# Altium schematic sheet xl4015.SchDoc
size A4
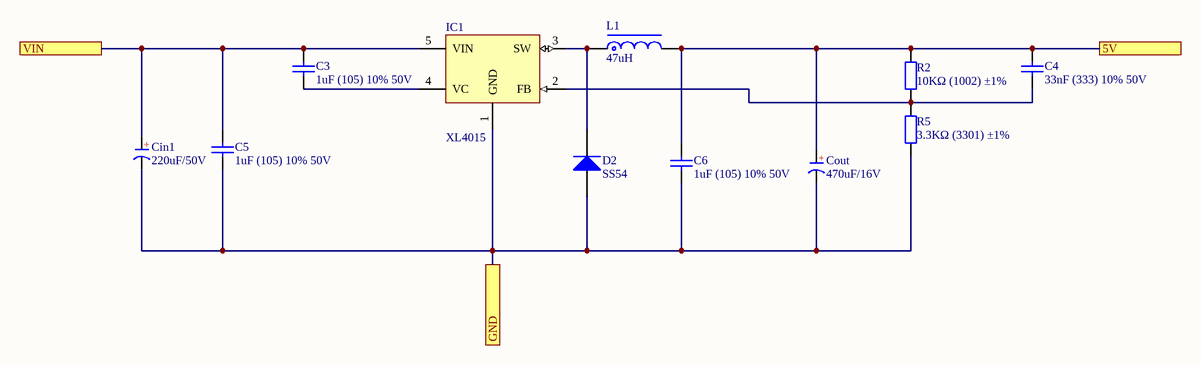
[diagram p0: xl4015.SchDoc]

## Parts
C3  1uF (105) 10% 50V  [0805_C]
C4  33nF (333) 10% 50V  [0805_C]
C5  1uF (105) 10% 50V  [0805_C]
C6  1uF (105) 10% 50V  [0805_C]
Cin1  220uF/50V  [CM F(10*10.2)]
Cout  470uF/16V  [CM E(8*10.2)]
D2  SS54  [SMA(DO-214AC)_S1]
IC1  XL4015  [TO263-5A]
L1  47uH  [CDRH127]
R2  10KΩ (1002) ±1%  [0805_R]
R5  3.3KΩ (3301) ±1%  [0805_R]

## Ports
5V, GND, VIN

## Nets
5V: C4.2 C6.2 Cout.1(A) L1.2 R2.2 ; port 5V
GND: C5.1 C6.1 Cin1.2(K) Cout.2(K) D2.1(A) IC1.1(GND) R5.1 ; port GND
VIN: C3.2 C5.2 Cin1.1(A) IC1.5(VIN) ; port VIN
NetC3_1: C3.1 IC1.4(VC)
NetC4_1: C4.1 IC1.2(FB) R2.1 R5.2
NetD2_2: D2.2(K) IC1.3(SW) L1.1

## Notes on the sheet
- (in symbol C-CM) +

## Library data of the parts
C3 C5 C6 = 0805 1uF (105) 10% 50V: 贴片电容; ComponentLink1Description: 供应商链接; ComponentLink1URL: http://www.szlcsc.com/product/details_29074.html; Package: 0805; Supplier: LC; SuppliersPartNumber: C28323
C4 = 0805 33nF (333) 10% 50V: 贴片电容; ComponentLink1Description: 供应商链接; ComponentLink1URL: http://www.szlcsc.com/product/details_2091.html; Package: 0805; Supplier: LC; SuppliersPartNumber: C1739
Cin1 Cout = C-CM: 贴片电解电容; 版权归属: 源创客; BOM名称: 贴片电解电容; 学习资源: www.ooocke.com
D2 = SMA(DO-214AC) SS54: 二极管; ComponentLink1Description: 供应商链接; ComponentLink1URL: http://www.szlcsc.com/product/details_23178.html; Package: SMA(DO-214AC); Supplier: LC; SuppliersPartNumber: C22452
IC1 = XL4015: DC降压芯片; 版权归属: 源创客; BOM名称: DC降压芯片; 学习资源: www.ooocke.com
L1 = L-CDRH: 功率屏蔽电感; 版权归属: 源创客; BOM名称: 功率屏蔽电感; 学习资源: www.ooocke.com
R2 = 0805 10KΩ (1002) 1%: 贴片电阻; ComponentLink1Description: 供应商链接; ComponentLink1URL: http://www.szlcsc.com/product/details_18102.html; Package: 0805; Supplier: LC; SuppliersPartNumber: C17414
R5 = 0805 3.3KΩ (3301) 1%: 贴片电阻; ComponentLink1Description: 供应商链接; ComponentLink1URL: http://www.szlcsc.com/product/details_26753.html; Package: 0805; Supplier: LC; SuppliersPartNumber: C26010